# EAGLE design Mother Board R2 (EAGLE 6.4)
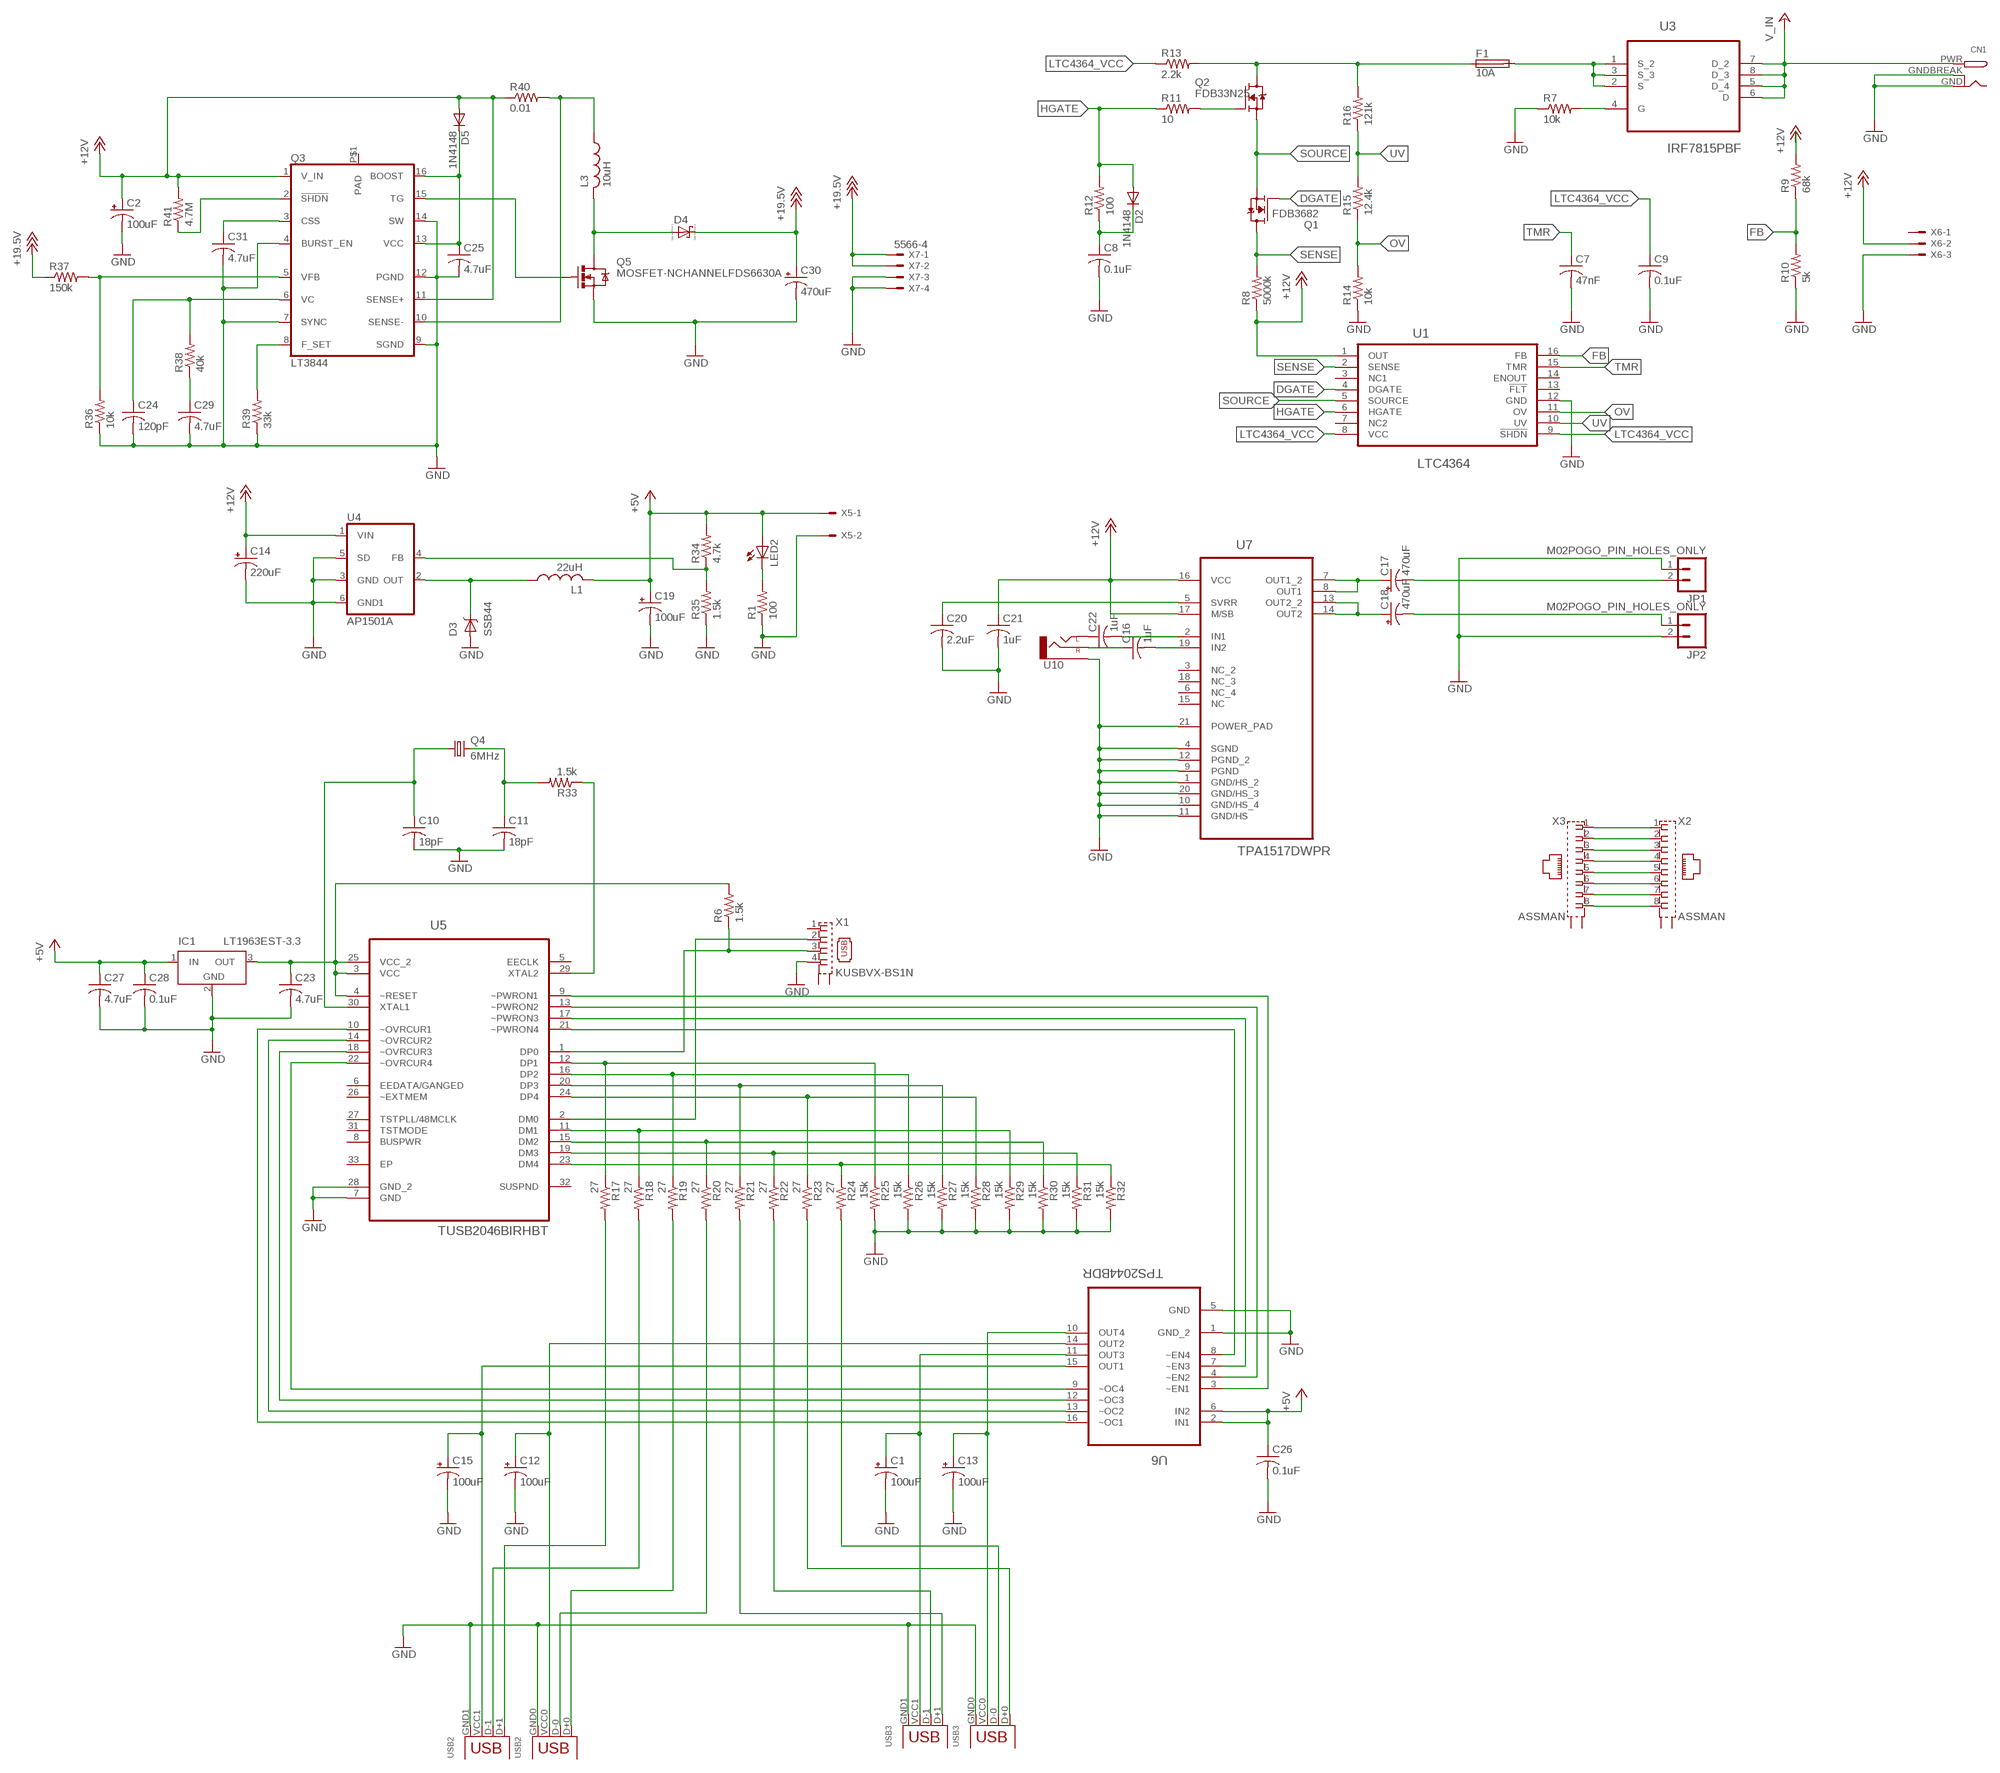
[diagram p0: schematic, sheet 1]

## Parts
C1  100uF  CPOL-USD  [PANASONIC_D]
C2  100uF  CPOL-USD  [PANASONIC_D]
C7  47nF  C-USC1206  [C1206]
C8  0.1uF  C-USC0603  [C0603]
C9  0.1uF  C-USC0603  [C0603]
C10  18pF  C-USC0603  [C0603]
C11  18pF  C-USC0603  [C0603]
C12  100uF  CPOL-USD  [PANASONIC_D]
C13  100uF  CPOL-USD  [PANASONIC_D]
C14  220uF  CPOL-USD  [PANASONIC_D]
C15  100uF  CPOL-USD  [PANASONIC_D]
C16  1uF  C-USC1206  [C1206]
C17  470uF  CPOL-USD  [PANASONIC_D]
C18  470uF  CPOL-USD  [PANASONIC_D]
C19  100uF  CPOL-USD  [PANASONIC_D]
C20  2.2uF  C-USC1206  [C1206]
C21  1uF  C-USC1206  [C1206]
C22  1uF  C-USC1206  [C1206]
C23  4.7uF  C-USC0805  [C0805]
C24  120pF  C-USC0805  [C0805]
C25  4.7uF  C-USC0805  [C0805]
C26  0.1uF  C-USC0603  [C0603]
C27  4.7uF  C-USC0805  [C0805]
C28  0.1uF  C-USC0603  [C0603]
C29  4.7uF  C-USC0805  [C0805]
C30  470uF  CPOL-USD  [PANASONIC_D]
C31  4.7uF  C-USC0805  [C0805]
CN1  DCBARRELPTH  [DCJACK_2MM_PTH]
D2  1N4148  [SOD323]
D3  SSB44  [SMB]
D4  SCHOTTKY-DIODESMC  [DIODE_SMC]
D5  1N4148  [SOD323]
F1  10A  MINIFUSE  [MINIFUSE]
IC1  LT1963EST-3.3  [SOT223]
JP1  M02POGO_PIN_HOLES_ONLY  [1X02_PP_HOLES_ONLY]
JP2  M02POGO_PIN_HOLES_ONLY  [1X02_PP_HOLES_ONLY]
L1  22uH  L-US  [BOURNSIND]
L3  10uH  L-US  [BOURNSIND]
LED2  LEDCHIPLED_1206  [CHIPLED_1206]
Q1  FDB3682  [TO263]
Q2  FDB33N25  [TO263]
Q3  LT3844  [TSSOP16-TPAD]
Q4  6MHz  CRYSTALHC49UP  [HC49UP]
Q5  MOSFET-NCHANNELFDS6630A  [SO08]
R1  100  R-US_R1206  [R1206]
R6  1.5k  R-US_R1206  [R1206]
R7  10k  R-US_R1206  [R1206]
R8  5000k  R-US_R1206  [R1206]
R9  68k  R-US_R1206  [R1206]
R10  5k  R-US_R1206  [R1206]
R11  10  R-US_R1206  [R1206]
R12  100  R-US_R1206  [R1206]
R13  2.2k  R-US_R1206  [R1206]
R14  10k  R-US_R1206  [R1206]
R15  12.4k  R-US_R1206  [R1206]
R16  121k  R-US_R1206  [R1206]
R17  27  R-US_R1206  [R1206]
R18  27  R-US_R1206  [R1206]
R19  27  R-US_R1206  [R1206]
R20  27  R-US_R1206  [R1206]
R21  27  R-US_R1206  [R1206]
R22  27  R-US_R1206  [R1206]
R23  27  R-US_R1206  [R1206]
R24  27  R-US_R1206  [R1206]
R25  15k  R-US_R1206  [R1206]
R26  15k  R-US_R1206  [R1206]
R27  15k  R-US_R1206  [R1206]
R28  15k  R-US_R1206  [R1206]
R29  15k  R-US_R1206  [R1206]
R30  15k  R-US_R1206  [R1206]
R31  15k  R-US_R1206  [R1206]
R32  15k  R-US_R1206  [R1206]
R33  1.5k  R-US_R1206  [R1206]
R34  4.7k  R-US_R1206  [R1206]
R35  1.5k  R-US_R1206  [R1206]
R36  10k  R-US_R1206  [R1206]
R37  150k  R-US_R1206  [R1206]
R38  40k  R-US_R1206  [R1206]
R39  33k  R-US_R1206  [R1206]
R40  0.01  R-US_R1206  [R1206]
R41  4.7M  R-US_R1206  [R1206]
U1  LTC4364  [MSOP-16]
U3  IRF7815PBF  [SOIC127P600X175-8N]
U4  AP1501A  [TO263-5]
U5  TUSB2046BIRHBT  [QFN50P500X500X100-33N]
U6  TPS2044BDR  [SOIC127P600X175-16N]
U7  TPA1517DWPR  [SOIC127P1030X265-21N]
U10  AUDIO-JACKPTH  [AUDIO-JACK]
USB2  DUALUSB  [USB-A-DS]
USB3  DUALUSB  [USB-A-DS]
X1  KUSBVX-BS1N  [KUSBVX-BS1N]
X2  ASSMAN  [ASSMAN]
X3  ASSMAN  [ASSMAN]
X5  KK-156-2  [KK-156-2]
X6  KK-156-3  [KK-156-3]
X7  5566-4  [5566-4]

## Nets
+5V: C19.+ C26.1 C27.1 C28.1 IC1.1(IN) L1.P$2 LED2.A R34.2 U6.2(IN1) U6.6(IN2) X5.1
+12V: C2.+ C14.+ C21.1 D5.A Q3.1(V_IN) Q3.11(SENSE+) R8.1 R9.2 R40.1 R41.2 U1.1(OUT) U4.1(VIN) U7.16(VCC) U7.17(M/SB) X6.2
+18V: C30.+ D4.C(A) R37.1 X7.1 X7.2 ; supply symbol labelled +19.5V
DGATE: Q1.1(G) U1.4(DGATE)
FB: R9.1 R10.2 U1.16(FB)
GND: C1.- C2.- C7.2 C8.2 C9.2 C10.2 C11.2 C12.- C13.- C14.- C15.- C19.- C20.2 C21.2 C23.2 C24.2 C25.2 C26.2 C27.2 C28.2 C29.2 C30.- C31.2 CN1.GND CN1.GNDBREAK D3.A IC1.2(GND) JP1.1 JP2.2 Q3.4(BURST_EN) Q3.7(SYNC) Q3.9(SGND) Q3.12(PGND) Q3.14(SW) Q5.1(S) Q5.2(S) Q5.3(S) R1.1 R7.1 R10.1 R14.1 R25.2 R26.2 R27.2 R28.2 R29.2 R30.2 R31.2 R32.2 R35.1 R36.1 R39.1 U1.12(GND) U4.3(GND) U4.5(SD) U4.6(GND1) U5.7(GND) U5.28(GND_2) U6.1(GND_2) U6.5(GND) U7.1(GND/HS_2) U7.4(SGND) U7.9(PGND) U7.10(GND/HS_4) U7.11(GND/HS) U7.12(PGND_2) U7.20(GND/HS_3) U7.21(POWER_PAD) U10.SLEEVE USB2.GND0(GND) USB2.GND1 USB3.GND0(GND) USB3.GND1 X1.4 X5.2 X6.3 X7.3 X7.4
HGATE: D2.A R11.1 R12.2 U1.6(HGATE)
LTC4364_VCC: C9.1 R13.1 U1.8(VCC) U1.9(!SHDN)
N$5: F1.P$1 Q2.3(D) R13.2 R16.2
N$7: D3.C L1.P$1 U4.2(OUT)
N$8: LED2.C R1.2
N$9: U5.2(DM0) X1.2
N$10: R6.1 U5.1(DP0) X1.3
N$11: C23.1 IC1.3(OUT) R6.2 U5.3(VCC) U5.4(~RESET) U5.25(VCC_2)
N$12: R17.1 R25.1 U5.12(DP1)
N$13: Q2.1(G) R11.2
N$14: R18.1 R29.1 U5.11(DM1)
N$15: C8.1 D2.C R12.1
N$16: R19.1 R26.1 U5.16(DP2)
N$17: F1.P$2 U3.1(S_2) U3.2(S) U3.3(S_3)
N$18: R20.1 R30.1 U5.15(DM2)
N$19: R7.2 U3.4(G)
N$20: R21.1 R27.1 U5.20(DP3)
N$21: R22.1 R31.1 U5.19(DM3)
N$22: R23.1 R28.1 U5.24(DP4)
N$23: R24.1 R32.1 U5.23(DM4)
N$24: C10.1 Q4.1 U5.30(XTAL1)
N$25: C11.1 Q4.2 R33.2
N$26: R33.1 U5.29(XTAL2)
N$27: U5.21(~PWRON4) U6.8(~EN4)
N$28: U5.17(~PWRON3) U6.7(~EN3)
N$29: U5.13(~PWRON2) U6.4(~EN2)
N$30: U5.9(~PWRON1) U6.3(~EN1)
N$31: U5.22(~OVRCUR4) U6.9(~OC4)
N$32: U5.18(~OVRCUR3) U6.12(~OC3)
N$33: U5.14(~OVRCUR2) U6.13(~OC2)
N$34: U5.10(~OVRCUR1) U6.16(~OC1)
N$35: C15.+ U6.15(OUT1) USB2.VCC1(VBUS1)
N$36: C12.+ U6.14(OUT2) USB2.VCC0(VBUS)
N$37: C1.+ U6.11(OUT3) USB3.VCC1(VBUS1)
N$38: C13.+ U6.10(OUT4) USB3.VCC0(VBUS)
N$39: R17.2 USB2.D+1
N$40: R18.2 USB2.D-1
N$41: R19.2 USB2.D+0(D+)
N$42: R20.2 USB2.D-0(D-)
N$43: R21.2 USB3.D+1
N$44: R22.2 USB3.D-1
N$45: R23.2 USB3.D+0(D+)
N$46: R24.2 USB3.D-0(D-)
N$47: C20.1 U7.5(SVRR)
N$48: C22.1 U10.TIP(LEFT)
N$49: C22.2 U7.2(IN1)
N$50: C16.1 U10.RING(RIGHT)
N$51: C16.2 U7.19(IN2)
N$52: C17.+ U7.7(OUT1_2) U7.8(OUT1)
N$53: C18.+ U7.13(OUT2_2) U7.14(OUT2)
N$54: C18.- JP2.1
N$55: C17.- JP1.2
N$56: X2.1 X3.1
N$57: X2.2 X3.2
N$58: X2.3 X3.3
N$59: X2.4 X3.4
N$60: X2.5 X3.5
N$61: X2.6 X3.6
N$62: X2.7 X3.7
N$63: X2.8 X3.8
N$65: R34.1 R35.2 U4.4(FB)
N$66: Q3.2(!SHDN) R41.1
N$67: C31.1 Q3.3(CSS)
N$69: C24.1 Q3.6(VC) R38.2
N$71: C29.1 R38.1
N$72: Q3.5(VFB) R36.2 R37.2
N$75: Q3.8(F_SET) R39.2
N$76: C25.1 D5.C Q3.13(VCC) Q3.16(BOOST)
N$78: L3.P$1 Q3.10(SENSE-) R40.2
N$79: Q3.15(TG) Q5.4(G)
N$80: D4.A(C) L3.P$2 Q5.5(D) Q5.6(D) Q5.7(D) Q5.8(D)
OV: R14.2 R15.1 U1.11(OV)
SENSE: Q1.3(D) R8.2 U1.2(SENSE)
SOURCE: Q1.2(S) Q2.2(S) U1.5(SOURCE)
TMR: C7.1 U1.15(TMR)
UV: R15.2 R16.1 U1.10(UV)
V_IN: CN1.PWR U3.5(D_4) U3.6(D) U3.7(D_2) U3.8(D_3)
Unconnected: Q3.P$1(PAD) U1.3(NC1) U1.7(NC2) U1.13(!FLT) U1.14(ENOUT) U5.5(EECLK) U5.6(EEDATA/GANGED) U5.8(BUSPWR) U5.26(~EXTMEM) U5.27(TSTPLL/48MCLK) U5.31(TSTMODE) U5.32(SUSPND) U5.33(EP) U7.3(NC_2) U7.6(NC_4) U7.15(NC) U7.18(NC_3) X1.1 X1.M1(S1) X1.M2(S2) X2.S1 X2.S2 X3.S1 X3.S2 X6.1

## Power pins joined to a net without a drawn wire
GND: IC1.4(GND)

## Library data of the parts
C1 C2 C12 C13 C15 C17-C19 C30 = resistor:CPOL-US: POLARIZED CAPACITOR, American symbol; MPN: 107SML016M; OC_NEWARK: 99M1145
C7 = resistor:C-US: CAPACITOR, American symbol; MPN: 12061C473KAZ1A; OC_NEWARK: 26M5748
C8 C9 C26 C28 = rcl:C-US: CAPACITOR, American symbol; MPN: 0603YC104MAT2A; OC_NEWARK: 96M1177
C10 C11 = resistor:C-US: CAPACITOR, American symbol; MF: AVX CORPORATION; MPN: 06035A180JAT2A; OC_NEWARK: 17C6481
C14 = resistor:CPOL-US: POLARIZED CAPACITOR, American symbol; MPN: 16SVPF270M; OC_NEWARK: 98W0218
C16 C21 C22 = resistor:C-US: CAPACITOR, American symbol; MPN: C1206C105K3RACTU; OC_NEWARK: 03M7475
C20 = resistor:C-US: CAPACITOR, American symbol; MPN: 1206YC225KAT2A; OC_NEWARK: 88W4192
C23-C25 C27 C29 C31 = resistor:C-US: CAPACITOR, American symbol; MPN: CGA4J3X7R1C475K125AB; OC_NEWARK: 04X3165
CN1 = adafruit:DCBARREL: 2.0mm DC Barrel Jack DCJACK_2MM_PTH - Through Hole Jack (4UConnector: 05537); OC_NEWARK: unknown
D2 D5 = Fairchild_By_element14_Batch_1:1N4148; MPN: 1N4148WS-7-F; OC_NEWARK: 12T2305
D3 = Vishay_By_element14_Batch_1:SSB44; MPN: SSB44-E3/52T; OC_NEWARK: 05R5881
D4 = eagle-ltspice:SCHOTTKY-DIODE: Schottky Diode; MPN: B550C-13-F; OC_NEWARK: 23T4617; SPICEMODEL: NONE; SPICEPREFIX: D; SPICETYPE: diode
F1 = fuse:MINIFUSE; MF: LITTELFUSE; MPN: 01530007Z; OC_NEWARK: 67K1420
IC1 = linear-technology:LT1963EST: 1.5A, Low Noise, Fast Transient Response LDO Regulator Source: http://www.linear.com/pc/downloadDocument.do?navId=H0,C3,P2222,D3148; MPN: LT1963EST-3.3; OC_FARNELL: 1501032; OC_NEWARK: 57M7546
JP1 JP2 = SparkFun-Connectors:M02: Standard 2-pin 0.1" header. Use with - straight break away headers ( PRT-00116) - right angle break away headers (PRT-00553) - swiss pins (PRT-00743) - machine pins (PRT-00117) - female headers (PRT-00115) Molex polarized connector foot print use with: PRT-08233 with associated crimp pins and housings. 2.54_SCREWTERM for use with PRT-10571. 3.5mm Screw Terminal footprints for PRT-08084 5mm Screw Terminal footprints for use with PRT-08433; OC_NEWARK: unknown
L1 L3 = resistor:L-US: INDUCTOR, American symbol; MPN: SRR1280-220M; OC_NEWARK: 07W8494
LED2 = led:LED: LED OSRAM: - CHIPLED LG R971, LG N971, LY N971, LG Q971, LY Q971, LO R971, LY R971 LH N974, LH R974 LS Q976, LO Q976, LY Q976 LO Q996 - Hyper CHIPLED LW Q18S LB Q993, LB Q99A, LB R99A - SideLED LS A670, LO A670, LY A670, LG A670, LP A670 LB A673, LV A673, LT A673, LW A673 LH A674 LY A675 LS A676, LA A676, LO A676, LY A676, LW A676 LS A679, LY A679, LG A679 - Hyper Micro SIDELED® LS Y876, LA Y876, LO Y876, LY Y876 LT Y87S - SmartLED LW L88C, LW L88S LB L89C, LB L89S, LG L890 LS L89K, LO L89K, LY L89K LS L896, LA L896, LO L896, LY L896 - TOPLED LS T670, LO T670, LY T670, LG T670, LP T670 LSG T670, LSP T670, LSY T670, LOP T670, LYG T670 LG T671, LOG T671, LSG T671 LB T673, LV T673, LT T673, LW T673 LH T674 LS T676, LA T676, LO T676, LY T676, LB T676, LH T676, LSB T676, LW T676 LB T67C, LV T67C, LT T67C, LS T67K, LO T67K, LY T67K, LW E67C LS E67B, LA E67B, LO E67B, LY E67B, LB E67C, LV E67C, LT E67C LW T67C LS T679, LY T679, LG T679 LS T770, LO T770, LY T770, LG T770, LP T770 LB T773, LV T773, LT T773, LW T773 LH T774 LS E675, LA E675, LY E675, LS T675 LS T776, LA T776, LO T776, LY T776, LB T776 LHGB T686 LT T68C, LB T68C - Hyper Mini TOPLED® LB M676 - Mini TOPLED Santana® LG M470 LS M47K, LO M47K, LY M47K Source: http://www.osram.convergy.de LUXEON: - LUMILED® LXK2-PW12-R00, LXK2-PW12-S00, LXK2-PW14-U00, LXK2-PW14-V00 LXK2-PM12-R00, LXK2-PM12-S00, LXK2-PM14-U00 LXK2-PE12-Q00, LXK2-PE12-R00, LXK2-PE12-S00, LXK2-PE14-T00, LXK2-PE14-U00 LXK2-PB12-K00, LXK2-PB12-L00, LXK2-PB12-M00, LXK2-PB14-N00, LXK2-PB14-P00, LXK2-PB14-Q00 LXK2-PR12-L00, LXK2-PR12-M00, LXK2-PR14-Q00, LXK2-PR14-R00 LXK2-PD12-Q00, LXK2-PD12-R00, LXK2-PD12-S00 LXK2-PH12-R00, LXK2-PH12-S00 LXK2-PL12-P00, LXK2-PL12-Q00, LXK2-PL12-R00 Source: www.luxeon.com KINGBRIGHT: KA-3528ASYC Source: www.kingbright.com; MPN: KP-3216CGCK; OC_NEWARK: 66W1932
Q1 = Fairchild_By_element14_Batch_1:FDB3682; MPN: STB35NF10T4; OC_NEWARK: 33R1119
Q2 = Fairchild_By_element14_Batch_1:FDB33N25; MPN: FDB33N25TM; OC_NEWARK: 84W8845
Q3 = linear:LT3844
Q4 = crystal:CRYSTAL: CRYSTAL; MPN: ABLSG-6.000MHZ-D-2-Y-T; OC_FARNELL: unknown; OC_NEWARK: 01T1342
Q5 = SparkFun-DiscreteSemi:MOSFET-NCHANNEL: Common NMOSFET Parts MFG P/N Store ID Prod ID FDD8780 TRANS-09984 SI7820DN TRANS-11055 FDS6630A IC-08089 2N7002PW TRANS-11151 FQP30N06L COM-10213 TRANS-10060 BSS123LT1G TRANS-08345 BSS138 TRANS-00830 BS170 2N7000; PROD_ID: IC-08089
R1 R12 = rcl:R-US_: RESISTOR, American symbol; MPN: MCHP06W2F1000T5E; OC_NEWARK: 01N7133
R6 R33 = resistor:R-US_: RESISTOR, American symbol; MPN: MCHP06W2F1501T5E; OC_NEWARK: 01N7147
R7 R14 = rcl:R-US_: RESISTOR, American symbol; MPN: MCHP06W2F1002T5E; OC_NEWARK: 01N7135
R8 = rcl:R-US_: RESISTOR, American symbol; MPN: CRCW12065M10JNEA; OC_NEWARK: 59M6999
R9 = rcl:R-US_: RESISTOR, American symbol; MF: VISHAY/DALE; MPN: CRCW120668K0FKEA; OC_NEWARK: 53K2569
R10 = rcl:R-US_: RESISTOR, American symbol; MPN: ERJ-8ENF5101V; OC_NEWARK: 53W4995
R11 = rcl:R-US_: RESISTOR, American symbol; MPN: CRM1206-FX-10R0ELF; OC_NEWARK: 17T4257
R13 = rcl:R-US_: RESISTOR, American symbol; MF: VISHAY/DALE; MPN: CRCW12062K20FKTA; OC_NEWARK: 07J5728
R15 = rcl:R-US_: RESISTOR, American symbol; MF: VISHAY/DALE; MPN: CRCW120612K4FKEA; OC_NEWARK: 53K1950
R16 = rcl:R-US_: RESISTOR, American symbol; MF: VISHAY/DALE; MPN: CRCW1206121KFKEA; OC_NEWARK: 53K1959
R17-R24 = resistor:R-US_: RESISTOR, American symbol; MPN: MCHP06W2F270JT5E; OC_NEWARK: 01N7163
R25-R32 = resistor:R-US_: RESISTOR, American symbol; MPN: MCHP06W2F1502T5E; OC_NEWARK: 01N7148
R34 R35 = resistor:R-US_: RESISTOR, American symbol; MPN: MC0125W12061120K; OC_NEWARK: 94W6493
R36-R41 = resistor:R-US_: RESISTOR, American symbol; MPN: MCHP06W2F1002T5E; OC_NEWARK: 01N7135
U1 = LTC4364-REDLINE:LTC4364: LTC4364; MPN: LTC4364IS-1#PBF; OC_NEWARK: 27W9491
U3 = International_Rectifier_By_element14_Batch_1:IRF7815PBF: HEXFET Power MOSFET; MPN: IRF7815PBF; OC_FARNELL: 1865585; OC_NEWARK: 57R4071; PACKAGE: SOIC-8; SUPPLIER: INTERNATIONAL RECTIFIER
U4 = Diodes_Inc_By_element14_Batch_1:AP1501A; OC_NEWARK: unknown
U5 = Texas Instruments_By_element14_Batch_1:TUSB2046BIRHBT: 4-PORT HUB FOR THE UNIVERSAL SERIAL BUS WITH OPTIONAL SERIAL EEPROM INTERFACE; MPN: TUSB2046BIRHBT; OC_FARNELL: 1610201; OC_NEWARK: 14N8499; PACKAGE: QFN-32; SUPPLIER: Texas Instruments
U6 = Texas Instruments_By_element14_Batch_1:TPS2044BDR: CURRENT-LIMITED, POWER-DISTRIBUTION SWITCHES; MF: TEXAS INSTRUMENT CONNECTORS; MPN: TPS2044BDR; OC_FARNELL: 1792053; OC_NEWARK: 90H4834; PACKAGE: SOIC-16; SUPPLIER: Texas Instruments
U7 = Texas Instruments_By_element14_Batch_1:TPA1517DWPR: 6-W STEREO AUDIO POWER AMPLIFIER; MF: TEXAS INSTRUMENTS; MPN: TPA1517DWPR; OC_FARNELL: 1535751; OC_NEWARK: 76C9773; PACKAGE: SO-20; SUPPLIER: Texas Instruments
U10 = SparkFun-Connectors:AUDIO-JACK: 3.5mm Audio Jack Simple 3.5mm common PCB mount audio jack. SKU: PRT-08032; MF: SPC CONNECTORS; MPN: SPC21348; OC_NEWARK: 11M0543
USB2 USB3 = con-usb-3:DUALUSB; MPN: 5787617-1; OC_NEWARK: 53K4503
X1 = con-kycon:KUSBVX-BS1N: USB B-type Receptacle Vertical, 4 Position, Through Hole Source: Sibalco Kycon KUSBVX-BS1N-xxx.pdf; MPN: MC32597; OC_NEWARK: 46P5310
X2 X3 = con-kycon:ASSMAN
X5 = con-molex:KK-156-2: KK 156 HEADER Source: http://www.molex.com/pdm_docs/sd/026604100_sd.pdf; OC_FARNELL: unknown; OC_NEWARK: unknown
X6 = con-molex:KK-156-3: KK 156 HEADER Source: http://www.molex.com/pdm_docs/sd/026604100_sd.pdf; OC_FARNELL: unknown; OC_NEWARK: unknown
X7 = con-molex:5566-4: Mini FIT connector 4 pol Source: http://www.molex.com; MPN: 39-29-9042; OC_FARNELL: unknown; OC_NEWARK: 34R5724

## Board
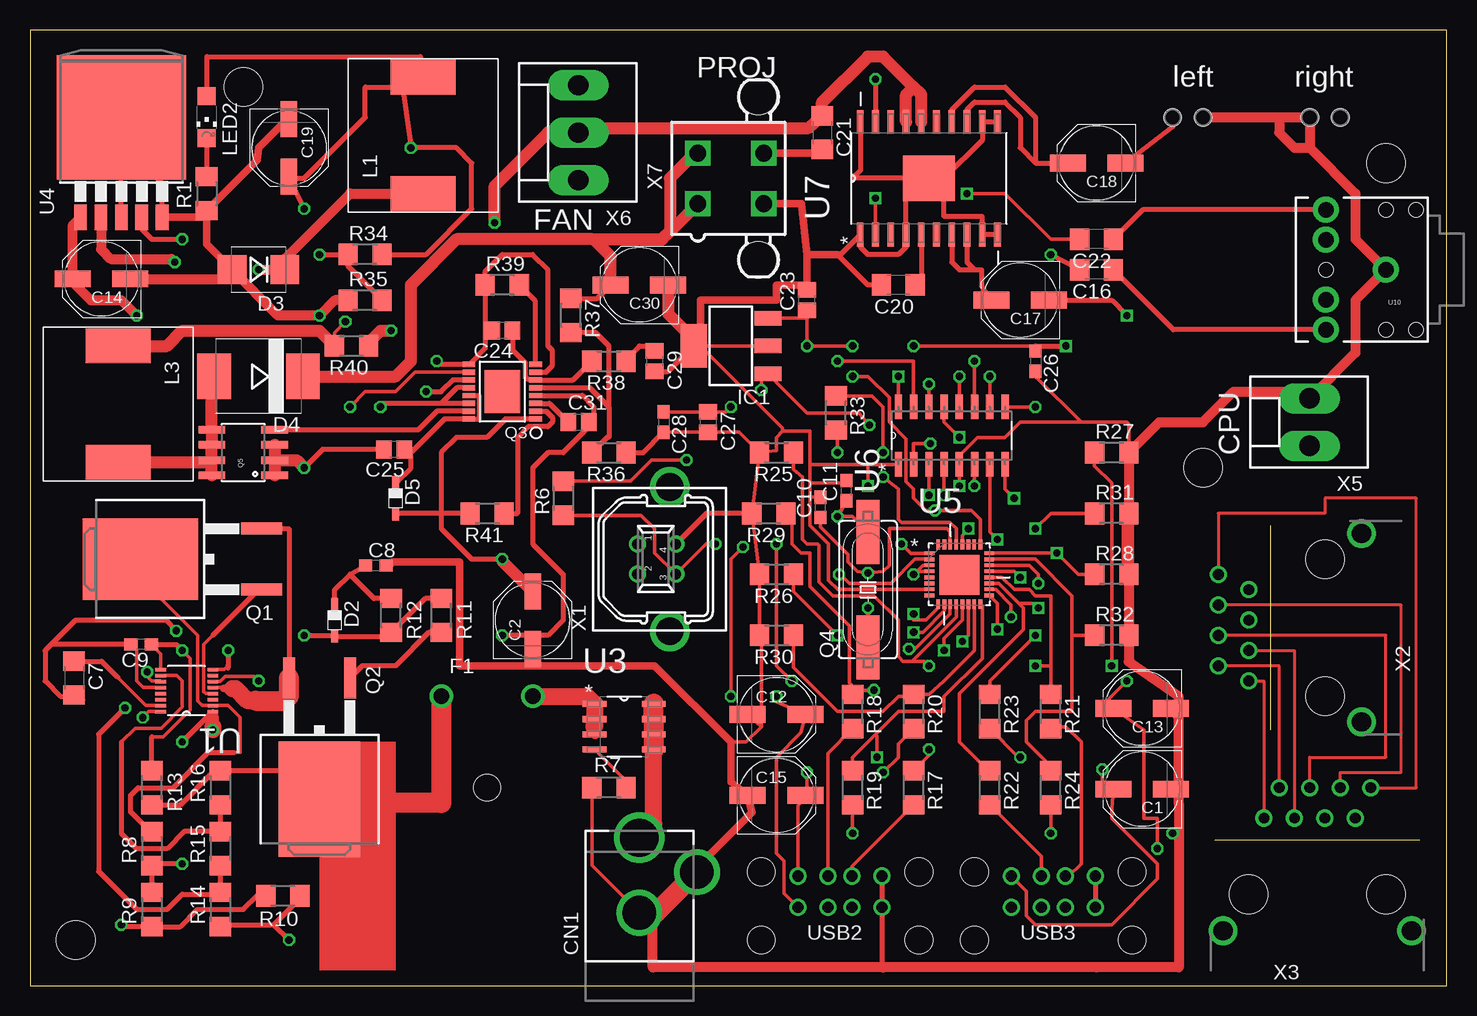
[diagram p1: board, top side]
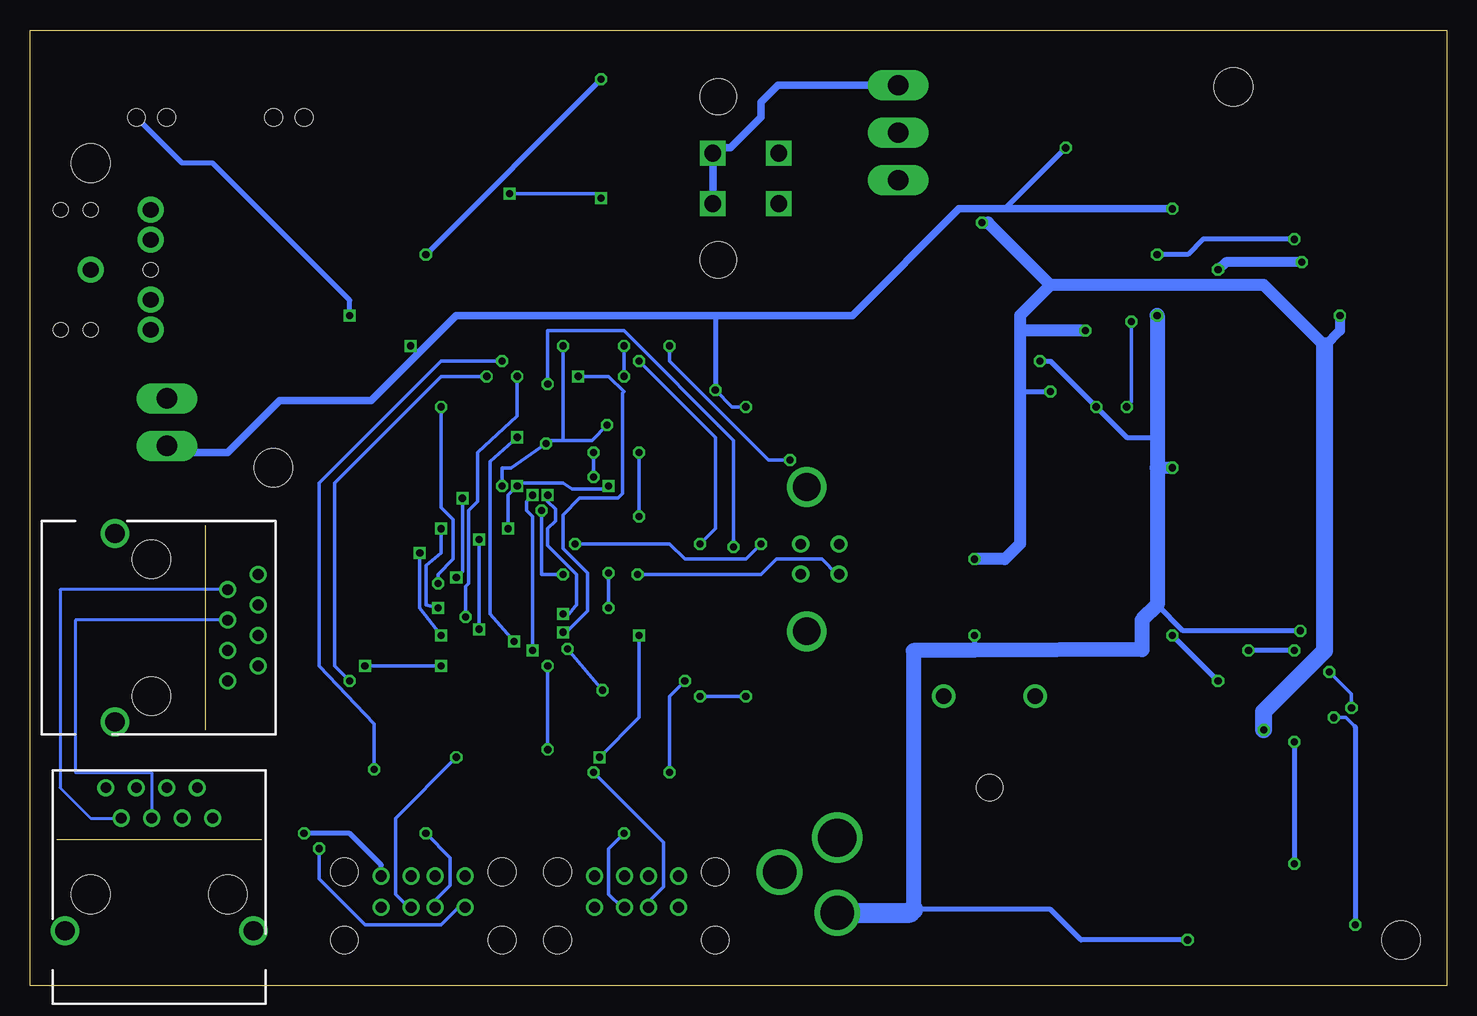
[diagram p2: board, bottom side, seen from below]

Size 118.09 x 79.68 mm. Coordinates in mm from the lower left corner, seen from the top.
Outline: 0,0 118.09,0 118.09,79.68 0,79.68 0,0
Copper layers (1*16): Top 0.035mm / dielectric 1.5mm / Bottom 0.035mm
Design rules "default *": minimum track width 6mil, minimum drill 15mil, track to track 5mil, track to pad 5mil, pad to pad 5mil, via to via 5mil, smd to smd 2mil, copper to edge 20mil, drill to drill 8mil, minimum pad ring 10mil, minimum via ring 8mil, stop-mask expansion 0mil, vias tented up to drill 0mil, thermal gap 10mil
Holes 3.2 mm at 3.81,3.81 97.79,43.18 113.03,68.58 17.78,74.93

### Footprints (pad centres in the part's own frame; a part is rotated, then mirrored left to right if it is on the bottom)
PANASONIC_D = smd 3 x 1.4: + 2.4,0; - -2.4,0
C1206 = smd 1.6 x 1.8: 1 -1.4,0; 2 1.4,0
C0603 = smd 1.1 x 1: 1 -0.85,0; 2 0.85,0
C0805 = smd 1.3 x 1.5: 1 -0.85,0; 2 0.85,0
DCJACK_2MM_PTH = drill 2.8: GND 0,7.35; GNDBREAK 4.8,10.75 | drill 3.2: PWR 0,13.6
SOD323 = smd 1 x 0.6: A 1.35,0; C -1.35,0
SMB = smd 2.4 x 2.4: A 2.2,0; C -2.2,0
DIODE_SMC = smd 2.8 x 3.8: A 3.7,0; C -3.7,0
MINIFUSE = drill 1.3: P$1 -3.81,7.62; P$2 3.81,7.62 | hole 2.2: 0,0
SOT223 = smd 1.219 x 2.235: 1 -2.311,-3.099; 2 0,-3.099; 3 2.311,-3.099 | smd 3.6 x 2.2: 4 0,3.099
1X02_PP_HOLES_ONLY = drill 0.889 pad 0.813: 1 0,0; 2 2.54,0 | hole 1.473: 0,0; 2.54,0
BOURNSIND = smd 2.9 x 5.4: P$1 0,0; P$2 9.7,0
CHIPLED_1206 = smd 1.5 x 1.5: A 0,-1.75; C 0,1.75
TO263 = smd 1 x 3.4: 1 -2.54,-7.87; 2 2.54,-7.87 | smd 6.8 x 9.6: 3 0,2.23
TSSOP16-TPAD = smd 0.45 x 1.05: 1 -2.275,-2.775; 2 -1.625,-2.775; 3 -0.975,-2.775; 4 -0.325,-2.775; 5 0.325,-2.775; 6 0.975,-2.775; 7 1.625,-2.775; 8 2.275,-2.775; 9 2.275,2.775; 10 1.625,2.775; 11 0.975,2.775; 12 0.325,2.775; 13 -0.325,2.775; 14 -0.975,2.775; 15 -1.625,2.775; 16 -2.275,2.775 | smd 3.581 x 2.946: P$1 0,0
HC49UP = smd 5.334 x 1.93: 1 -4.826,0; 2 4.826,0
SO08 = smd 0.61 x 2.21: 1 -1.905,-2.616; 2 -0.635,-2.616; 3 0.635,-2.616; 4 1.905,-2.616; 5 1.905,2.616; 6 0.635,2.616; 7 -0.635,2.616; 8 -1.905,2.616
R1206 = smd 1.6 x 1.803: 1 -1.422,0; 2 1.422,0
MSOP-16 = smd 0.889 x 0.305: 1 0,0; 2 0,-0.5; 3 0,-1; 4 0,-1.5; 5 0,-2; 6 0,-2.5; 7 0,-3; 8 0,-3.5; 9 4.34,-3.5; 10 4.34,-3; 11 4.34,-2.5; 12 4.34,-2; 13 4.34,-1.5; 14 4.34,-1; 15 4.34,-0.5; 16 4.34,0
SOIC127P600X175-8N = smd 1.981 x 0.508: 1 -2.464,1.905; 2 -2.464,0.635; 3 -2.464,-0.635; 4 -2.464,-1.905; 5 2.464,-1.905; 6 2.464,-0.635; 7 2.464,0.635; 8 2.464,1.905
TO263-5 = smd 1.067 x 2.159: 1 -3.404,-7.061; 2 -1.702,-7.061; 3 0,-7.061; 4 1.702,-7.061; 5 3.404,-7.061 | smd 10.8 x 10.41: 6 0,1.27
QFN50P500X500X100-33N = smd 0.813 x 0.305: 1 -2.489,1.753; 2 -2.489,1.245; 3 -2.489,0.762; 4 -2.489,0.254; 5 -2.489,-0.254; 6 -2.489,-0.762; 7 -2.489,-1.245; 8 -2.489,-1.753; 17 2.489,-1.753; 18 2.489,-1.245; 19 2.489,-0.762; 20 2.489,-0.254; 21 2.489,0.254; 22 2.489,0.762; 23 2.489,1.245; 24 2.489,1.753 | smd 0.305 x 0.813: 9 -1.753,-2.489; 10 -1.245,-2.489; 11 -0.762,-2.489; 12 -0.254,-2.489; 13 0.254,-2.489; 14 0.762,-2.489; 15 1.245,-2.489; 16 1.753,-2.489; 25 1.753,2.489; 26 1.245,2.489; 27 0.762,2.489; 28 0.254,2.489; 29 -0.254,2.489; 30 -0.762,2.489; 31 -1.245,2.489; 32 -1.753,2.489 | smd 3.353 x 3.353: 33 0,-0.051
SOIC127P600X175-16N = smd 2.057 x 0.61: 1 -4.801,8.89; 2 -4.801,7.62; 3 -4.801,6.35; 4 -4.801,5.08; 5 -4.801,3.81; 6 -4.801,2.54; 7 -4.801,1.27; 8 -4.801,0; 9 0,0; 10 0,1.27; 11 0,2.54; 12 0,3.81; 13 0,5.08; 14 0,6.35; 15 0,7.62; 16 0,8.89
SOIC127P1030X265-21N = smd 1.981 x 0.559: 1 -4.699,5.715; 2 -4.699,4.445; 3 -4.699,3.175; 4 -4.699,1.905; 5 -4.699,0.635; 6 -4.699,-0.635; 7 -4.699,-1.905; 8 -4.699,-3.175; 9 -4.699,-4.445; 10 -4.699,-5.715; 11 4.699,-5.715; 12 4.699,-4.445; 13 4.699,-3.175; 14 4.699,-1.905; 15 4.699,-0.635; 16 4.699,0.635; 17 4.699,1.905; 18 4.699,3.175; 19 4.699,4.445; 20 4.699,5.715 | smd 3.81 x 4.318: 21 0,0
AUDIO-JACK = drill 1.3 pad 2.184: RING 5,5; RSH 5,2.5; SLEEVE 0,0; TIP 5,-5; TSH 5,-2.5 | hole 1.2: 0,5; -2.5,5; -2.5,-5; 0,-5; 5,0
USB-A-DS = drill 0.92: D+0 7.57,2.71; D+1 7.57,5.33; D-0 5.57,2.71; D-1 5.57,5.33; GND0 10.07,2.71; GND1 10.07,5.33; VCC0 3.07,2.71; VCC1 3.07,5.33 | hole 2.3: 0,0; 0,5.68; 13.14,0; 13.14,5.68
KUSBVX-BS1N = drill 0.9 pad 1.422: 1 1.25,2.7; 2 -1.25,2.7; 3 -1.25,-0.5; 4 1.25,-0.5 | drill 2.3 pad 2.7: M1 -6.02,0; M2 6.02,0
ASSMAN = drill 0.9 pad 1.422: 1 1.27,6.35; 2 2.54,8.89; 3 3.81,6.35; 4 5.08,8.89; 5 6.35,6.35; 6 7.62,8.89; 7 8.89,6.35; 8 10.16,8.89 | drill 1.6 pad 2.184: S1 -2.14,-3.05; S2 13.57,-3.05 | hole 3.2: 0,0; 11.43,0
KK-156-2 = drill 1.7 pad 2.184 long: 1 -1.98,0; 2 1.98,0
KK-156-3 = drill 1.7 pad 2.184 long: 1 -3.96,0; 2 0,0; 3 3.96,0
5566-4 = drill 1.4 square: 1 2.1,-2.75; 2 -2.1,-2.75; 3 2.1,2.75; 4 -2.1,2.75 | hole 3: 6.8,2.29; -6.8,2.29

### Placement (x,y rotation side)
C1  92.71,16.38 180 top
C2  41.91,30.48 90 top
C7  3.68,25.65 270 top
C8  28.83,35.05 0 top
C9  9.27,28.45 180 top
C10  65.91,39.88 90 top
C11  68.07,41.27 90 top
C12  62.23,22.61 0 top
C13  92.71,23.11 180 top
C14  5.97,58.93 180 top
C15  62.23,15.88 0 top
C16  88.9,59.69 180 top
C17  82.55,57.15 180 top
C18  88.9,68.58 180 top
C19  21.59,69.85 270 top
C20  72.39,58.42 180 top
C21  66.04,71.12 270 top
C22  88.9,62.23 180 top
C23  64.77,57.15 90 top
C24  39.37,54.61 180 top
C25  30.35,44.7 180 top
C26  83.82,52.07 270 top
C27  56.52,46.99 270 top
C28  52.83,46.99 270 top
C29  52.07,52.07 270 top
C30  50.8,58.42 180 top
C31  45.72,46.99 0 top
CN1  50.8,-1.27 0 top
D2  25.4,30.48 270 top
D3  19.05,59.69 180 top
D4  19.05,50.8 180 top
D5  30.48,40.64 270 top
F1  38.1,16.51 0 top
IC1  58.42,53.34 90 top
JP1  106.68,72.39 0 top
JP2  95.25,72.39 0 top
L1  32.77,66.04 90 top
L3  7.37,53.34 270 top
LED2  14.73,72.39 180 top
Q1  11.43,35.56 90 top
Q2  24.13,17.78 180 top
Q3  39.37,49.53 90 top
Q4  69.85,33.02 90 top
Q5  17.78,44.45 90 top
R1  14.73,66.04 90 top
R6  44.45,40.64 90 top
R7  48.26,16.51 0 top
R8  10.16,11.43 90 top
R9  10.16,6.35 90 top
R10  21.08,7.49 180 top
R11  34.29,30.86 270 top
R12  30.1,30.86 270 top
R13  10.16,16.51 270 top
R14  15.88,6.35 90 top
R15  15.88,11.43 90 top
R16  15.88,16.51 90 top
R17  73.66,16.51 270 top
R18  68.58,22.86 270 top
R19  68.58,16.51 270 top
R20  73.66,22.86 270 top
R21  85.09,22.86 270 top
R22  80.01,16.51 270 top
R23  80.01,22.86 270 top
R24  85.09,16.51 270 top
R25  62.23,44.45 180 top
R26  62.23,34.29 180 top
R27  90.17,44.45 0 top
R28  90.17,34.29 0 top
R29  61.59,39.37 180 top
R30  62.23,29.21 180 top
R31  90.17,39.37 0 top
R32  90.17,29.21 0 top
R33  67.18,47.75 270 top
R34  27.94,60.96 0 top
R35  27.94,57.15 0 top
R36  48.26,44.45 180 top
R37  45.09,55.88 270 top
R38  48.26,52.07 180 top
R39  39.37,58.42 0 top
R40  26.8,53.34 180 top
R41  38.1,39.37 180 top
U1  15.24,22.86 180 top
U3  49.53,21.59 0 top
U4  7.62,71.12 0 top
U5  77.47,34.29 0 top
U6  81.28,48.26 90 top
U7  74.93,67.31 90 top
U10  113.03,59.69 180 top
USB2  60.96,3.81 0 top
USB3  78.74,3.81 0 top
X1  53.34,35.56 90 top
X2  107.95,24.13 90 top
X3  101.6,7.62 0 top
X5  106.68,46.99 90 top
X6  45.72,71.12 90 top
X7  58.42,67.31 270 top

### Tracks (layer width: path | path; a pad name or v marks a point on that pad's centre or on a via)
+5V  (via drill 0.6)
  Top 0.305: U6.6 v78.74,41.66 | v75.06,45.21 73.66,45.21 U6.2 | v69.98,46.74 69.09,47.75 64.77,47.75 61.52,51 IC1.1 60.96,50.47 v60.96,49.66 | v73.66,53.34 83.4,53.34 C26.1 | C28.1 C27.1 58,47.84 v58.42,48.26
  Top 0.406: C26.1 83.82,53.34 v86.36,53.34 | C19.+ 21.59,67.31 | 21.59,67.31 22.86,67.31 27.94,72.39 27.94,74.93 33.02,74.93 | v22.86,64.77 21.59,67.31 | R34.2 33.02,60.96 36.83,64.77 36.83,68.58 35.56,69.85 v31.75,69.85 30.94,75.74 L1.P$2 32.56,77.47 14.73,77.47 LED2.A
  Bottom 0.305: v78.74,41.66 78.74,43.18 77.98,43.18 v75.06,45.21 74.68,45.47 73.66,45.47 | v69.98,46.74 71.25,45.47 73.66,45.47 | v73.66,53.34 73.66,45.47 | v58.42,48.26 59.56,48.26 v60.96,49.66
  Bottom 0.406: v86.36,53.34 85.72,52.7 | v31.75,69.85 36.83,64.77 | 68.58,55.88 60.96,55.88 60.96,49.53
  Bottom 0.61: v22.86,64.77 36.83,64.77 40.64,64.77 49.53,55.88 68.58,55.88 82.55,55.88 85.72,52.7 89.66,48.77 97.28,48.77 101.6,44.45 106.12,44.45 X5.1
+12V  (via drill 0.6)
  Top 0.305: U1.1 15.24,22.35
  Top 0.406: R9.2 R8.1 10.31,10.16 v12.7,10.16 | U1.1 v12.7,20.32 | R41.2 34.29,39.37 | 34.29,39.37 30.56,39.37 D5.A | 34.29,39.37 34.29,38.1 36.83,35.56 v39.37,35.56 | Q3.1 39.63,47.26 38.1,45.72 35.56,45.72 34.29,44.45 34.29,39.37 | v33.02,49.53 34.29,49.53 35.27,50.51 Q3.11
  Top 0.813: U4.1 3.57,63.41 C14.+ 3.57,58.66 5.08,57.15 7.62,57.15 v8.89,55.88
  Top 1.016: 15.24,22.35 15.24,21.59 | v39.37,35.56 39.37,35.42 C2.+ | R40.1 28.22,53.62 29.21,54.61 v30.1,54.61 | U7.16 74.3,74.3 73.66,74.93 | 73.66,74.93 71.12,77.47 69.85,77.47 66.04,73.66 C21.1 64.89,71.5 46.1,71.5 X6.2 43.18,71.12 38.73,66.67 v38.73,63.63 | U7.17 73.03,74.3 73.66,74.93
  Top 1.422: 15.24,21.59 v15.24,21.34
  Bottom 0.406: v12.7,20.32 v12.7,10.16 | 35.56,49.53 v33.02,49.53
  Bottom 0.813: v8.89,55.88 8.89,54.61 10.16,53.34
  Bottom 1.016: 10.16,53.34 15.24,58.42 33.02,58.42 | 33.02,58.42 35.56,55.88 35.56,54.61 | 35.56,54.61 35.56,49.53 35.56,36.83 36.83,35.56 v39.37,35.56 | v30.1,54.61 35.56,54.61 | v38.73,63.63 38.23,63.63 33.02,58.42
  Bottom 1.422: v15.24,21.34 U1.1 10.16,27.94 10.16,53.34
+18V
  Top 0.406: R37.1 47.28,57.3 C30.+
  Top 0.813: 46.88,62.23 46.99,62.23
  Top 1.016: D4.C 30.48,50.8 31.75,52.07 31.75,58.42 35.56,62.23 46.88,62.23 | C30.+ 48.4,60.82 46.99,62.23 52.69,62.23 53.34,62.88 | 53.34,62.88 X7.1 | X7.2 55.44,69.41 53.34,67.31 53.34,62.88
DGATE
  Top 0.305: U1.4 14.63,24.36 14.48,24.51 14.48,28.45 15.24,29.21
  Top 0.406: Q1.1 19.05,33.02 15.24,29.21
FB  (via drill 0.6)
  Top 0.305: U1.16 9.91,22.86 v9.4,22.35
  Top 0.406: R10.2 18.92,7.49 17.78,6.35 13.97,6.35 12.55,4.93 R9.1 7.77,4.93 v7.62,5.08
  Bottom 0.305: v9.4,22.35 8.38,22.35 7.62,21.59
  Bottom 0.406: 7.62,21.59 v7.62,5.08
GND  (via drill 0.6)
  Top 0.305: 65.02,41.91 65.02,43.43 | 65.02,43.43 65.02,46.23 62.74,46.23 | 62.74,46.23 62.23,45.72 62.23,44.6 R25.2 | U6.1 69.85,43.46 | 69.85,43.46 68.3,43.46 65.02,43.43 | U5.28 77.72,37.54 77.98,37.85 v78.23,38.1 | v69.85,41.66 69.85,43.46 | v77.47,41.66 U6.5 77.47,44.2 78.99,45.72 81.28,45.72 82.55,46.99 87.63,46.99 | R25.2 R29.2 R26.2 R30.2 61.45,28.57 60.96,29.21 60.96,21.59 | R27.2 91.59,46.84 91.44,46.99 87.63,46.99 | U5.7 67.33,33.05 66.55,33.78 66.55,36.83 65.02,38.35 65.02,40.64 | 65.02,40.64 65.02,41.91 | 65.02,41.91 67.93,41.91 C11.2 | IC1.4 55.88,53.34 | 55.88,53.34 IC1.2 | 62.74,46.23 62.74,46.48 55.88,53.34 | C28.2 C27.2 59.12,46.14 R25.2 | C26.2 83.95,50.67 87.63,46.99 | 58.42,20.32 59.69,20.32 60.96,21.59 | 60.96,21.59 C12.- | C1.- 95.76,15.24 | C13.- 95.76,21.59 | 4.49,23.82 4.19,24.13 | C10.2 65.11,40.73 65.02,40.64 | U1.12 9.43,24.86 8.89,25.4 8.89,27.98 C9.2 | R7.1 46.84,10.04 CN1.GND
  Top 0.406: C7.2 4.19,24.13 | C9.2 1.78,28.45 | 1.78,28.45 1.27,27.94 1.27,25.4 2.54,24.13 3.56,24.13 C7.2 | R29.2 56.4,39.37 X1.4 | U4.5 11.02,66.9 7.62,70.31 | C20.2 69.85,58.42 67.31,60.96 67.56,60.96 U7.1 69.22,61.59 69.85,60.96 72.39,60.96 73.03,61.59 U7.4 73.03,66.67 73.66,67.31 | 73.66,67.31 U7.21 76.2,67.31 | 73.66,67.31 68.58,67.31 69.22,67.94 U7.20 | U7.11 U7.12 79.38,70.48 76.2,67.31 | U7.10 U7.9 79.38,64.14 76.2,64.14 76.2,67.31 | 4.11,23.82 C7.2 | R10.1 22.5,7.26 20.32,5.08 | 16.51,5.08 16.03,5.08 R14.1 16.36,4.93 16.51,5.08 | 16.51,5.08 20.32,5.08 | 20.32,5.08 v21.59,3.81 | USB2.GND0 USB2.GND1 71.03,1.61 71.12,1.52 | USB3.GND1 USB3.GND0 | 88.81,1.61 88.9,1.52 | v95.25,12.7 95.76,12.7 | R28.2 91.59,34.44 | U4.6 7.62,70.31 | U4.3 7.62,70.31 | 1.78,28.45 3.81,30.48 11.3,30.48 v12.19,29.59 | C25.2 24.38,44.7 v22.86,43.18 | C29.2 53.2,51.22 IC1.4 | Q3.4 46.05,49.2 46.99,48.26 46.99,47.41 C31.2 46.57,46.57 44.45,44.45 43.18,44.45 41.91,43.18 41.91,36.83 44.45,34.29 44.45,30.48 43.18,29.21 41.91,29.21 | R36.1 51.14,44.45 C28.2 | R39.1 37.95,55.18 C24.2 | R39.1 37.95,53.16 Q3.9 34.17,51.8 v33.91,52.07 | Q3.14 34.29,48.55 | 34.29,48.55 29.5,48.55 v29.21,48.26 | Q3.12 35.59,49.85 34.29,48.55 | Q3.7 43.03,51.16 43.56,51.69 43.56,52.96 43.18,53.34 43.18,59.69 41.91,60.96 39.37,60.96 37.95,59.54 R39.1 | 41.91,29.21 C2.- | 41.91,29.21 v39.37,29.21
  Top 0.61: C8.2 29.97,35.05 30.23,35.31 35.81,35.31 35.81,26.67 52.07,26.67 58.42,20.32 58.42,17 C15.- 60.18,14.46 55.88,10.16 | 55.88,53.34 55.88,57.15 62.23,57.15 62.23,58.42 64.35,58.42 | 64.35,58.42 C23.2 | 67.31,60.96 64.77,60.96 | 64.35,58.42 64.77,58.42 64.77,60.96 | X7.4 65.73,69.41 C21.2 | X7.3 64.33,65.21 64.77,60.96 | C19.- 21.45,72.25 19.05,69.85 18.92,68.81 R1.1 | R1.1 14.73,61.81 D3.A | U4.5 14.68,64.06 R1.1
  Top 0.813: R28.2 R32.2 91.59,27.01 95.76,24.12 95.76,21.59 95.76,15.24 95.76,12.7 95.76,1.52 88.9,1.52 71.12,1.52 51.9,1.52 51.9,4.98 CN1.GND | R31.2 R27.2 94.13,46.99 97.79,46.99 100.33,49.53 106.12,49.53 X5.2 110.49,52.78 110.49,57.15 U10.SLEEVE 110.49,62.23 110.49,66.04 106.68,69.85 | R31.2 91.59,34.44 91.44,34.29 91.44,39.22 R31.2 | C14.- 16.09,58.93 D3.A 20.66,55.88 v24.13,55.88 25.4,57.15 R35.1 | JP2.2 104.14,72.39 | 104.14,72.39 JP1.1 106.68,69.85 | 104.14,72.39 104.14,71.12 105.41,69.85 106.68,69.85
  Top 1.016: Q5.3 Q5.2 | Q5.2 Q5.1 | Q5.2 22.23,43.81 v22.86,43.18 | C30.- 53.2,56.02 55.88,53.34
  Top 1.676: CN1.GND 52.2,6.08 CN1.GNDBREAK
  Bottom 0.305: v78.23,38.1 78.23,40.89 v77.47,41.66 77.47,41.91 73.66,41.91 72.9,41.4 70.1,41.4 v69.85,41.66
  Bottom 0.406: v21.59,3.81 30.48,3.81 33.02,6.35 44.45,6.35 47.07,6.35 | USB3.GND1 88.81,10.07 91.44,12.7 v95.25,12.7 | 24.13,31.75 21.97,29.59 v12.19,29.59 | 24.13,45.72 26.67,45.72 v29.21,48.26 33.02,52.07 v33.91,52.07 | v39.37,29.21 39.37,27.97 39.37,27.96
  Bottom 0.61: X6.3 55.73,75.08 57.15,73.66 57.15,72.39 59.69,69.85 60.73,69.85 X7.4 X7.3
  Bottom 1.016: v22.86,43.18 24.13,43.18
  Bottom 1.27: v24.13,55.88 24.13,45.72 24.13,43.18 24.13,31.75 25.4,30.48 25.4,28.02 39.37,27.96 44.45,27.94 44.45,6.35
  Bottom 1.676: CN1.GND 44.72,6.08 44.45,6.35
HGATE  (via drill 0.6)
  Top 0.305: U1.6 15.84,25.36 16.26,25.78 18.67,25.78 v19.05,25.4
  Top 0.406: v22.86,29.21 25.32,29.21 D2.A 29.79,29.13 R12.2 32.94,32.28 R11.1
  Bottom 0.406: v19.05,25.4 v22.86,29.21
LTC4364_VCC  (via drill 0.6)
  Top 0.305: U1.8 16.2,26.36 16.51,26.67 | U1.9 10.9,27.67 C9.1 | 10.16,20.75 11.1,20.75 13.34,22.99 13.34,27.3 v12.7,27.94
  Top 0.406: R13.1 10.16,20.75 | v16.51,27.94 16.51,26.67 16.51,26.49 | C9.1 12.19,28.45 v12.7,27.94
  Bottom 0.406: v12.7,27.94 v16.51,27.94
N$5
  Top 0.406: Q2.3 21.9,17.78 21.59,17.78 21.44,17.93 R16.2 15.72,17.78 15.24,17.78 12.55,15.09 R13.2
  Top 1.676: F1.P$1 34.29,15.24 24.44,15.24 Q2.3
N$7  (via drill 0.6)
  Top 0.61: D3.C 21.25,60.62
  Top 0.813: U4.2 5.92,61.39 6.73,60.58 11.81,60.58 v12.06,60.33 | v19.05,59.69 D3.C | 21.25,60.62 26.67,66.04 L1.P$1
  Bottom 0.813: v12.06,60.33 18.41,60.33 v19.05,59.69
N$8
  Top 0.406: LED2.C R1.2
N$9  (via drill 0.6)
  Top 0.305: v67.44,34.29 67.56,34.29 68.33,33.53 71.75,33.53 73.79,35.56 74.95,35.56 U5.2
  Bottom 0.305: v67.44,34.29 57.15,34.29 55.88,35.56 52.07,35.56 50.8,34.29 50.66,34.29 X1.2
N$10  (via drill 0.6)
  Top 0.305: R6.1 50.95,39.22 52.07,38.1 52.07,36.08 X1.3 56.36,36.83 v57.15,36.83 | U5.1 73.43,36.04 v72.64,36.83
  Bottom 0.305: v72.64,36.83 64.77,36.83 63.5,35.56 58.42,35.56 v57.15,36.83
N$11  (via drill 0.6)
  Top 0.305: v54.74,43.81 51.82,43.81 50.06,42.06 R6.2 | IC1.3 64.67,55.65 C23.1 v64.77,53.34 v68.58,53.34 | U5.25 79.22,38.89 78.49,39.62 v75.44,39.62 74.68,39.62 73.66,40.64 73.66,41.4 73.03,42.04 73.03,45.59 71.63,46.99 71.63,49.02 69.85,50.8 v68.58,50.8 | U5.3 74.42,35.05 v73.66,34.29 73.66,34.54 U5.4
  Bottom 0.305: v54.74,43.81 56.52,43.81 64.77,52.07 v64.77,53.34 | v73.66,34.29 75.44,34.29 v75.44,39.62 | v68.58,50.8 v68.58,53.34
N$12  (via drill 0.6)
  Top 0.305: R25.1 63.65,43.03 64.39,42.42 64.39,37.21 64.77,36.83 65.66,36.83 65.79,36.7 65.79,33.66 66.93,32.51 70.36,32.51 72.39,30.48 72.39,27.43 72.77,27.05 73.53,27.05 | U5.12 77.22,30.73 73.53,27.05 | 73.53,27.05 74.55,27.05 v74.93,26.67 | v74.93,19.68 74.93,19.2 R17.1
  Bottom 0.305: v74.93,26.67 v74.93,19.68
N$13
  Top 0.406: R11.2 33.25,29.44 30.48,26.67 27.69,26.67 Q2.1
N$14  (via drill 0.6)
  Top 0.305: v73.28,28.07 73.66,28.07 73.66,27.94 76.71,30.99 U5.11 | v70.36,24.64 68.94,24.64 | 68.94,24.64 R18.1 | 68.94,24.64 68.33,25.25 68.33,29.97 65.02,33.27 65.02,36.07 64.26,36.07 63.5,36.83 63.5,38.89 R29.1
  Bottom 0.305: v73.28,28.07 v70.36,24.64
N$15
  Top 0.406: D2.C 25.4,33.02 26.67,34.29 | 26.67,34.29 C8.1 | R12.1 28.68,32.28 26.67,34.29
N$16  (via drill 0.6)
  Top 0.305: R19.1 68.58,19.05 70.48,20.95 | 70.48,20.95 72.39,22.86 76.2,22.86 76.2,24.13 79.38,27.3 79.38,31.65 U5.16 | R26.1 63.65,32.87 v67.31,29.21 | v70.61,19.05 70.61,20.83 70.48,20.95
  Bottom 0.305: v67.31,29.21 67.31,22.35 v70.61,19.05
N$17
  Top 0.813: U3.1 U3.2 U3.3
  Top 1.422: F1.P$2 46.43,24.13 U3.1 47.07,21.67 46.99,21.59
N$18
  Top 0.305: U5.15 78.74,31.77 78.74,27.94 76.2,25.4 74.93,24.28 R20.1 73.51,24.13 72.39,24.13 71.12,22.86 67.31,22.86 63.65,26.52 R30.1
N$19
  Top 0.305: R7.2 49.68,17.07 U3.4
N$20  (via drill 0.6)
  Top 0.305: R21.1 85.09,26.67 | 85.09,26.67 85.09,32.51 83.82,32.51 83.31,33.02 82.04,33.02 81.03,34.04 U5.20 | R27.1 88.75,43.33 90.17,41.91 v90.17,26.67 | v83.82,26.67 85.09,26.67
  Bottom 0.305: v90.17,26.67 v83.82,26.67
N$21  (via drill 0.6)
  Top 0.305: R22.1 79.86,17.93 77.47,20.32 77.47,24.38 82.8,29.72 82.8,31.5 82.42,31.88 | 82.42,31.88 80.77,33.53 U5.19 | R31.1 85.09,39.37 v83.82,38.1 | v84.07,31.5 84.07,31.88 82.42,31.88
  Bottom 0.305: v83.82,38.1 83.82,36.07 85.09,35.05 85.09,31.75 v84.07,31.5
N$22  (via drill 0.6)
  Top 0.305: R23.1 80.01,25.4 v83.82,29.21 | U5.24 79.98,36.07 v85.6,36.07 87.38,34.29 R28.1
  Bottom 0.305: v83.82,29.21 85.6,31.5 v85.6,36.07
N$23
  Top 0.305: R24.1 85.09,18.29 83.06,20.32 83.06,22.1 83.82,22.86 86.87,22.86 86.87,29.21 | 86.87,29.21 86.87,32.51 83.82,35.56 79.98,35.56 U5.23 | R32.1 86.87,29.21
N$24  (via drill 0.6)
  Top 0.305: U5.30 76.71,37.85 76.45,38.1 71.63,38.1 71.63,35.05 71.12,34.54 v69.85,34.42 68.96,34.54 68.2,35.31 68.2,35.94 65.91,38.23 C10.1 | Q4.1 v69.85,31.5
  Bottom 0.305: v69.85,31.5 v69.85,34.42
N$25  (via drill 0.6)
  Top 0.305: C11.1 v67.31,39.12 68.58,39.12 Q4.2 | v67.31,44.45 67.31,45.44 R33.2
  Bottom 0.305: v67.31,39.12 v67.31,44.45
N$26  (via drill 0.6)
  Top 0.305: U5.29 77.22,38.1 76.71,38.61 72.64,38.61 72.39,38.86 72.39,41.4 v71.12,42.42 | R33.1 70.21,49.17 71.12,48.26 v71.12,44.45
  Bottom 0.305: v71.12,42.42 v71.12,44.45
N$27  (via drill 0.6)
  Top 0.305: U6.8 81.28,41.4 v82.04,40.64 | v82.55,34.04 82.04,34.54 U5.21
  Bottom 0.305: v82.04,40.64 82.04,34.54 v82.55,34.04
N$28  (via drill 0.6)
  Top 0.305: U6.7 80.01,37.85 v80.64,37.21 | v80.64,29.72 80.64,31.85 U5.17
  Bottom 0.305: v80.64,37.21 v80.64,29.72
N$29  (via drill 0.6)
  Top 0.305: U5.13 77.72,30.48 76.2,28.96 v76.2,27.94 | v76.2,40.89 U6.4
  Bottom 0.305: v76.2,27.94 76.2,39.12 76.71,39.62 76.71,40.39 v76.2,40.89
N$30  (via drill 0.6)
  Top 0.305: U5.9 75.72,31.52 74.68,30.48 73.66,30.48 v73.66,30.99 | v74.93,40.89 U6.3
  Bottom 0.305: v73.66,30.99 73.15,30.99 72.64,31.62 72.52,31.75 72.52,34.29 74.93,36.7 74.93,38.1 74.3,38.73 74.3,39.75 74.93,40.39 v74.93,40.89
N$31  (via drill 0.6)
  Top 0.305: U6.9 v83.82,48.26 | v84.07,33.53 84.07,34.29 83.31,35.05 U5.22
  Bottom 0.305: v83.82,48.26 83.82,39.88 82.8,38.86 82.8,35.56 84.07,34.29 v84.07,33.53
N$32  (via drill 0.6)
  Top 0.305: U5.18 79.98,33.05 80.01,33.02 80.52,33.02 81.79,31.75 v81.79,30.73 | v77.47,50.8 U6.12
  Bottom 0.305: v81.79,30.73 81.79,33.27 81.53,33.53 81.53,39.62 80.77,40.39 80.77,44.45 77.47,47.5 v77.47,50.8
N$33  (via drill 0.6)
  Top 0.305: U5.14 78.23,29.21 v77.72,28.7 | v77.47,45.72 76.2,46.99 U6.13
  Bottom 0.305: v77.72,28.7 79.76,30.99 79.76,43.69 v77.47,45.72
N$34  (via drill 0.6)
  Top 0.305: U5.10 76.22,31.27 74.42,29.46 v73.66,29.46 | v72.39,50.8 U6.16
  Bottom 0.305: v72.39,50.8 69.85,50.8 68.58,49.53 68.71,49.4 68.71,41.02 69.09,40.64 72.26,40.64 73.66,39.24 73.66,36.45 71.63,34.42 71.63,31.24 73.41,29.46 v73.66,29.46
N$35  (via drill 0.6)
  Top 0.305: U6.15 73.66,52.07 v67.31,52.07 | v62.23,36.83 62.23,26.67 v63.5,25.4 | v64.77,17.78 64.77,15.73 C15.+ 64.03,14.99 USB2.VCC1
  Bottom 0.305: v67.31,52.07 60.96,45.72 60.96,38.1 v62.23,36.83 | v63.5,25.4 64.77,24.13 v64.77,17.78
N$36  (via drill 0.6)
  Top 0.305: U6.14 v74.93,50.16 | v59.44,36.58 58.42,35.56 v58.42,24.13 | 65.16,21.98 C12.+ | v62.23,24.13 62.23,23.64 C12.+ | C12.+ 64.28,21.1 62.23,19.05 62.23,11.05 62.87,10.41 62.87,7.68 USB2.VCC0
  Bottom 0.305: v74.93,50.16 74.93,54.61 68.58,54.61 59.44,45.47 v59.44,36.58 | v58.42,24.13 v62.23,24.13
N$37  (via drill 0.6)
  Top 0.305: U6.11 v78.74,52.07 | v89.41,18.03 89.39,16.75 C1.+ 90.17,14.75 90.17,13.97 93.98,10.16 93.98,8.89 90.17,5.08 83.82,5.08 83.06,5.84 83.06,7.87 81.81,9.12 USB3.VCC1
  Bottom 0.305: v78.74,52.07 83.82,52.07 93.98,41.91 93.98,26.67 89.41,21.84 v89.41,18.03
N$38  (via drill 0.6)
  Top 0.305: v91.44,25.4 89.39,23.35 C13.+ 92.84,21.32 92.84,13.97 93.98,13.97 v93.98,11.43 | v80.01,50.8 U6.10
  Bottom 0.305: v91.44,25.4 92.71,26.67 92.71,41.91 83.82,50.8 v80.01,50.8 | USB3.VCC0 82.38,6.52 83.82,5.08 90.17,5.08 93.98,8.89 v93.98,11.43
N$39
  Top 0.305: USB2.D+1 68.53,9.96 R17.2
N$40
  Top 0.305: 68.43,21.44 R18.2 66.53,19.39 USB2.D-1
N$41  (via drill 0.6)
  Top 0.305: v68.58,12.7 R19.2
  Bottom 0.305: USB2.D+0 68.75,6.52 69.85,7.62 69.85,11.43 v68.58,12.7
N$42  (via drill 0.6)
  Top 0.305: 73.66,20.95 R20.2 72.39,20.17 72.39,19.05 v71.12,17.78
  Bottom 0.305: USB2.D-0 66.53,7 65.28,8.26 65.28,11.94 v71.12,17.78
N$43
  Top 0.305: 85.09,20.95 R21.2 85.24,21.59 86.36,21.59 87.63,20.32 87.63,10.16 86.61,9.14 USB3.D+1
N$44
  Top 0.305: 80.01,14.61 R22.2 84.31,10.79 USB3.D-1
N$45  (via drill 0.6)
  Top 0.305: 80.01,20.95 R23.2 82.4,19.05 v82.55,19.05
  Bottom 0.305: USB3.D+0 86.53,6.52 87.63,7.62 87.63,13.97 v82.55,19.05
N$46  (via drill 0.6)
  Top 0.305: v85.09,12.7 R24.2
  Bottom 0.305: USB3.D-0 84.31,7.13 83.06,8.38 83.06,10.67 v85.09,12.7
N$47
  Top 0.406: U7.5 74.3,58.92 C20.1
N$48
  Top 0.406: U10.TIP 92.76,64.69 C22.1
N$49  (via drill 0.6)
  Top 0.305: C22.2 85.09,62.23 81.28,66.04 v78.11,66.04 | v70.48,65.66 U7.2
  Bottom 0.305: v78.11,66.04 70.87,66.04 v70.48,65.66
N$50
  Top 0.406: U10.RING 95.3,54.69 C16.1
N$51  (via drill 0.6)
  Top 0.406: C16.2 v85.09,60.96 | v70.48,75.56 U7.19
  Bottom 0.406: v85.09,60.96 v70.48,75.56
N$52
  Top 0.406: U7.7 76.83,60.33 77.47,59.69 78.74,59.69 | 78.74,59.69 79.33,59.69 79.33,58.32 C17.+ | U7.8 78.11,60.33 78.74,59.69
N$53
  Top 0.406: U7.13 78.11,73.03 78.74,73.66 81.28,73.66 82.55,72.39 82.55,69.85 83.82,68.58 | U7.14 76.83,73.03 78.74,74.93 81.28,74.93 83.82,72.39 83.82,68.58 | 83.82,68.58 C18.+
N$54
  Top 0.406: JP2.1 95.25,71.61 C18.-
N$55  (via drill 0.6)
  Top 0.406: C17.- 90.17,57.15 v91.44,55.88
  Bottom 0.406: v91.44,55.88 91.44,57.15 102.87,68.58 105.41,68.58 JP1.2
N$56
  Top 0.254: X2.1 102.87,25.4 X3.1
N$57
  Top 0.254: X3.2 104.14,26.67 X2.2
N$58
  Top 0.254: X2.3 105.41,27.94 X3.3
N$59
  Top 0.254: X3.4 106.68,19.05 113.03,19.05 113.03,29.21 X2.4
N$60
  Bottom 0.254: X2.5 114.3,30.48 114.3,17.78 107.95,17.78 X3.5
N$61
  Top 0.254: X3.6 109.22,17.78 114.3,17.78 114.3,31.75 X2.6
N$62
  Bottom 0.254: X2.7 115.57,33.02 115.57,16.51 113.03,13.97 X3.7
N$63
  Top 0.254: X3.8 115.57,16.51 115.57,40.64 107.95,40.64 107.95,39.37 99.06,39.37 X2.8
N$65  (via drill 0.6)
  Top 0.406: R35.2 26.52,59.99 R34.1 v24.13,60.96 | U4.4 9.32,63.07 10.16,62.23 v12.7,62.23
  Bottom 0.406: v12.7,62.23 20.32,62.23 21.59,60.96 v24.13,60.96
N$66
  Top 0.406: R41.1 40.64,39.37 40.64,45.72 41.53,46.61 43.18,46.61 43.56,46.99 43.56,47.37 43.03,47.91 Q3.2
N$67
  Top 0.406: Q3.3 43.3,48.55 C31.1
N$69
  Top 0.406: R38.2 45.27,50.51 Q3.6 41.57,50.51 41.27,50.8 41.27,51.94 40.22,53 C24.1
N$71
  Top 0.406: R38.1 49.68,52.22 50.8,53.34 51.65,53.34 C29.1
N$72
  Top 0.406: Q3.5 46.66,49.85 48.26,48.26 | 48.26,48.26 48.26,45.72 48.11,45.72 R36.2 | 48.26,48.26 48.26,53.34 47.14,54.46 R37.2
N$75
  Top 0.406: Q3.8 42.15,57.07 R39.2
N$76
  Top 0.406: D5.C 30.56,41.99 31.75,43.18 31.75,44.16 31.6,44.3 | 31.6,44.3 C25.1 | 31.6,44.3 34.55,47.26 Q3.16 37.45,47.26 37.47,47.24 37.47,49.15 37.41,49.2 Q3.13
N$78  (via drill 0.6)
  Top 0.305: R40.2 25.38,54.46 v26.29,55.37 | v26.67,48.26 27.94,49.53 30.48,49.53 32.1,51.16 Q3.10
  Top 1.016: L3.P$1 11.43,53.34 12.7,54.61 24.11,54.61 R40.2
  Bottom 0.305: v26.29,55.37 26.29,48.64 v26.67,48.26
N$79
  Top 0.406: Q3.15 33.94,47.91 32.38,46.35 Q5.4
N$80
  Top 0.813: 15.16,51.88 D4.A
  Top 1.016: L3.P$2 14.99,43.64 Q5.7 | Q5.8 Q5.7 | Q5.7 Q5.6 Q5.5 15.16,50.61 D4.A
OV  (via drill 0.6)
  Top 0.305: v9.78,26.16 9.78,25.78 10.16,25.4 10.86,25.4 U1.11
  Top 0.406: R15.1 R14.2 16.51,7.77 15.24,7.62 12.7,7.62 11.43,6.35 8.89,6.35 5.71,9.53 5.71,20.95 v7.92,23.16
  Bottom 0.305: v7.92,23.16 7.92,24.31 v9.78,26.16
SENSE
  Top 0.305: 17.02,19.43 17.53,19.43 17.53,22.35 16.52,23.36 U1.2 14.36,23.36 13.97,23.75 13.97,29.21 8.89,34.29 8.89,35.25 Q1.3
  Top 0.406: R8.2 10.01,12.85 8.38,14.48 8.38,15.88 9.02,16.51 11.94,16.51 14.86,19.43 17.02,19.43
SOURCE
  Top 0.305: U1.5 15.91,24.86 16.13,24.77
  Top 0.406: Q1.2 21.59,38.1 Q2.2
  Top 0.61: 16.13,24.77 16.64,24.77
  Top 1.016: 16.64,24.77 16.89,24.77
  Top 1.422: 16.89,24.77 17.14,24.77 18.16,23.75 18.8,23.75
  Top 1.676: 18.8,23.75 21.21,23.75 21.59,24.13 Q2.2
TMR
  Top 0.305: U1.15 9.66,23.36 7.32,25.7
  Top 0.406: C7.1 5.97,27.05 7.32,25.7
UV
  Top 0.305: U1.10 12.24,25.86 12.7,25.4 12.7,23.24 10.92,21.46 8.76,21.46 7.62,20.32
  Top 0.406: R16.1 16.03,15.24 16.51,15.24 15.88,14.61 R15.2 12.85,12.85 11.43,11.43 8.89,11.43 7.62,12.7 7.62,20.32
V_IN
  Top 1.422: CN1.PWR 51.99,13.52 U3.5
  Top 1.676: U3.5 U3.6 U3.7 U3.8
(copper drawn outside any net)
  shapes: Top area x1

### Text on the board
tNames: PROJ | left | right | FAN | CPU